# EAGLE schematic AR - Attack Release (EAGLE 6.6.0)

## Sheet 1 of 3: Power
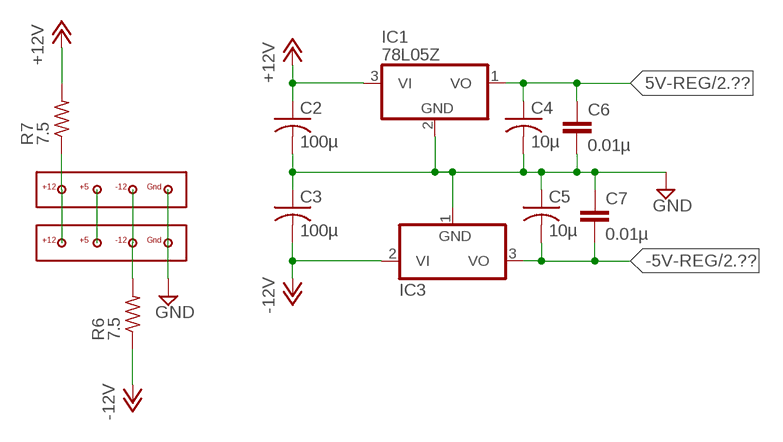
[diagram p0: schematic, sheet 1]

### Parts
C2  100µ  C-US025-050X050  [C025-050X050]
C3  100µ  C-US025-050X050  [C025-050X050]
C4  10µ  C-US025-050X050  [C025-050X050]
C5  10µ  C-US025-050X050  [C025-050X050]
C6  0.01µ  C2.5/2  [C2.5-2]
C7  0.01µ  C2.5/2  [C2.5-2]
IC1  78L05Z  [TO92]
IC3  79L05Z  [TO92]
R6  7.5  R-US_0204/7  [0204/7]
R7  7.5  R-US_0204/7  [0204/7]
U$3  POWER_CONNECTOR_4_RGBB  [POWER_CONNECTOR_4_RGBB]
U$7  POWER_CONNECTOR_4_RGBB  [POWER_CONNECTOR_4_RGBB]

### Nets
5V-REG: C4.1 C6.1 IC1.1(VO) ; also sheet 2
+12V: C2.1 IC1.3(VI) R7.2 ; also sheet 2
-5V-REG: C5.2 C7.2 IC3.3(VO) ; also sheet 2
-12V: C3.2 IC3.2(VI) R6.1 ; also sheet 3
GND: C2.2 C3.1 C4.2 C5.1 C6.2 C7.1 IC1.2(GND) IC3.1(GND) U$3.GND U$7.GND ; also sheet 2,3
N$10: R7.1 U$3.+12 U$7.+12
N$11: U$3.+5 U$7.+5
N$12: R6.2 U$3.-12 U$7.-12

## Sheet 2 of 3: Attack-Release
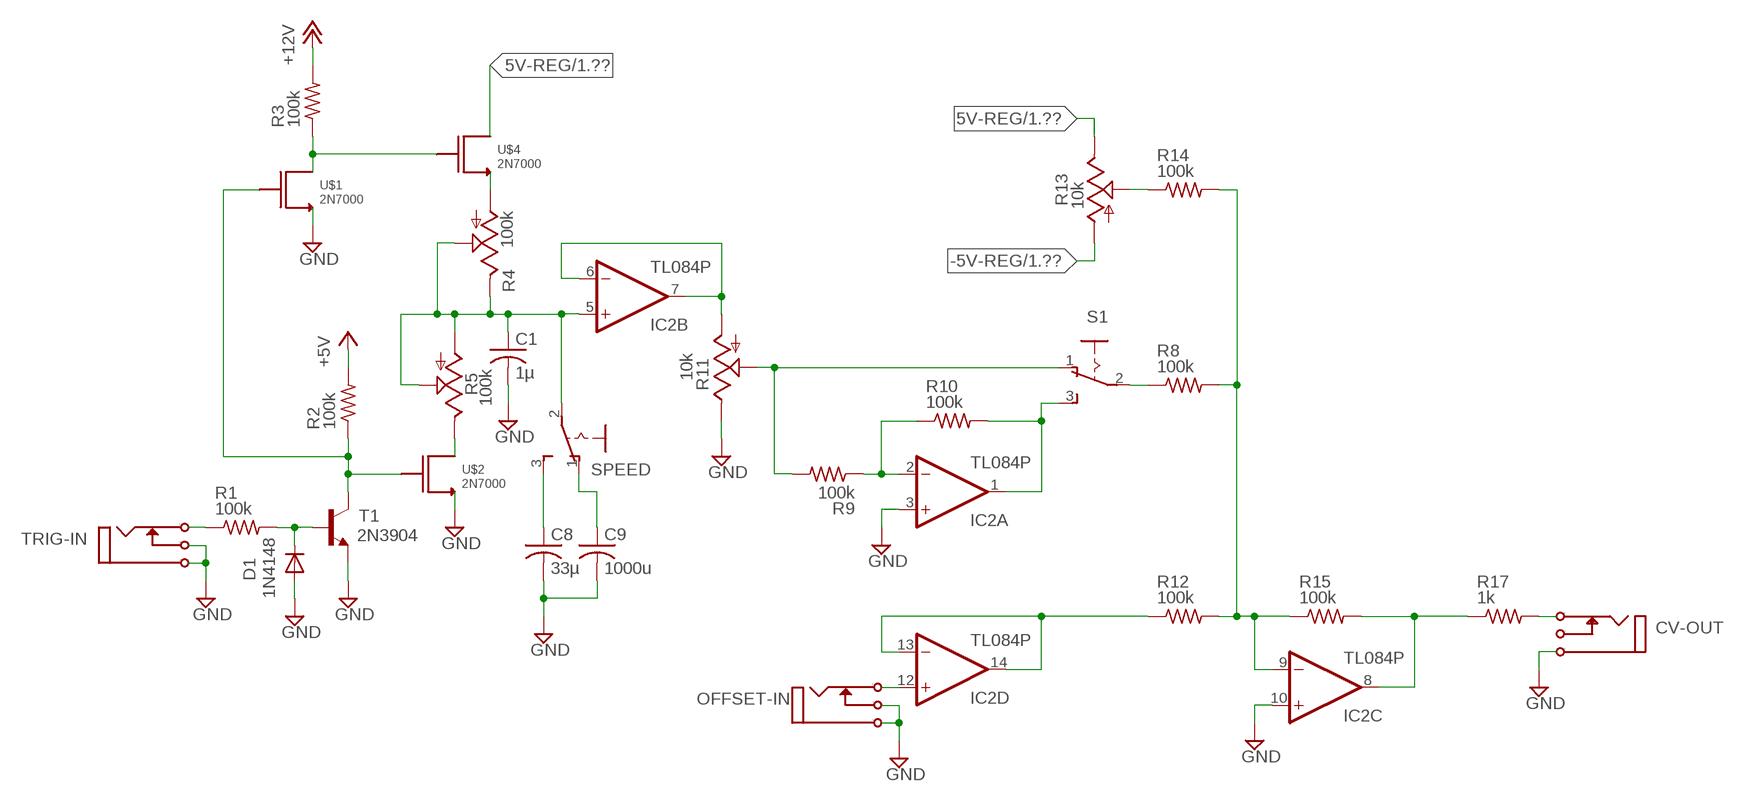
[diagram p1: schematic, sheet 2]

### Parts
C1  1µ  C-US025-050X050  [C025-050X050]
C8  33µ  C-US025-050X050  [C025-050X050]
C9  1000u  C-US025-050X050  [C025-050X050]
CV-OUT  I/O  MONO_JACK  [MONO_JACK]
D1  1N4148  1N4148DO35-7  [DO35-7]
IC2  TL084P  [DIL14]
OFFSET-IN  I/O  MONO_JACK  [MONO_JACK]
R1  100k  R-US_0204/7  [0204/7]
R2  100k  R-US_0204/7  [0204/7]
R3  100k  R-US_0204/7  [0204/7]
R4  100k  TRIM_US-B64Y  [B64Y]
R5  100k  TRIM_US-B64Y  [B64Y]
R8  100k  R-US_0204/7  [0204/7]
R9  100k  R-US_0204/7  [0204/7]
R10  100k  R-US_0204/7  [0204/7]
R11  10k  TRIM_US-B64Y  [B64Y]
R12  100k  R-US_0204/7  [0204/7]
R13  10k  TRIM_US-B64Y  [B64Y]
R14  100k  R-US_0204/7  [0204/7]
R15  100k  R-US_0204/7  [0204/7]
R17  1k  R-US_0204/7  [0204/7]
S1  255SB  [255SB]
SPEED  255SB  [255SB]
T1  2N3904  [TO92]
TRIG-IN  I/O  MONO_JACK  [MONO_JACK]
U$1  2N7000  [2N7000]
U$2  2N7000  [2N7000]
U$4  2N7000  [2N7000]

### Nets
5V-REG: R13.E U$4.D ; also sheet 1
+5V: R2.2
+12V: R3.2 ; also sheet 1
+12V1: C8.1 SPEED.3(S)
-5V-REG: R13.A ; also sheet 1
GND: C1.2 C8.2 C9.2 CV-OUT.P$1 D1.A IC2.3(A:+IN) IC2.10(C:+IN) OFFSET-IN.P$1 OFFSET-IN.P$3(P3) R11.E T1.3(E) TRIG-IN.P$1 TRIG-IN.P$3(P3) U$1.S U$2.S ; also sheet 1,3
N$1: R1.1 TRIG-IN.P$2(P2)
N$2: D1.C R1.2 T1.2(B)
N$3: R2.1 T1.1(C) U$1.G U$2.G
N$4: R3.1 U$1.D U$4.G
N$6: IC2.6(B:-IN) IC2.7(B:OUT) R11.A
N$7: R5.E U$2.D
N$8: C1.1 IC2.5(B:+IN) R4.E R4.S R5.A R5.S SPEED.2(P)
N$9: R4.A U$4.S
N$13: IC2.13(D:-IN) IC2.14(D:OUT) R12.1
N$15: IC2.1(A:OUT) R10.2 S1.3(S)
N$17: R9.2 R11.S S1.1(O)
N$18: IC2.2(A:-IN) R9.1 R10.1
N$19: R8.1 S1.2(P)
N$20: IC2.9(C:-IN) R8.2 R12.2 R14.2 R15.1
N$21: R13.S R14.1
N$23: IC2.8(C:OUT) R15.2 R17.1
N$25: CV-OUT.P$2(P2) R17.2
N$26: C9.1 SPEED.1(O)
N$28: IC2.12(D:+IN) OFFSET-IN.P$2(P2)
Unconnected: CV-OUT.P$3(P3)

## Sheet 3 of 3: VCA
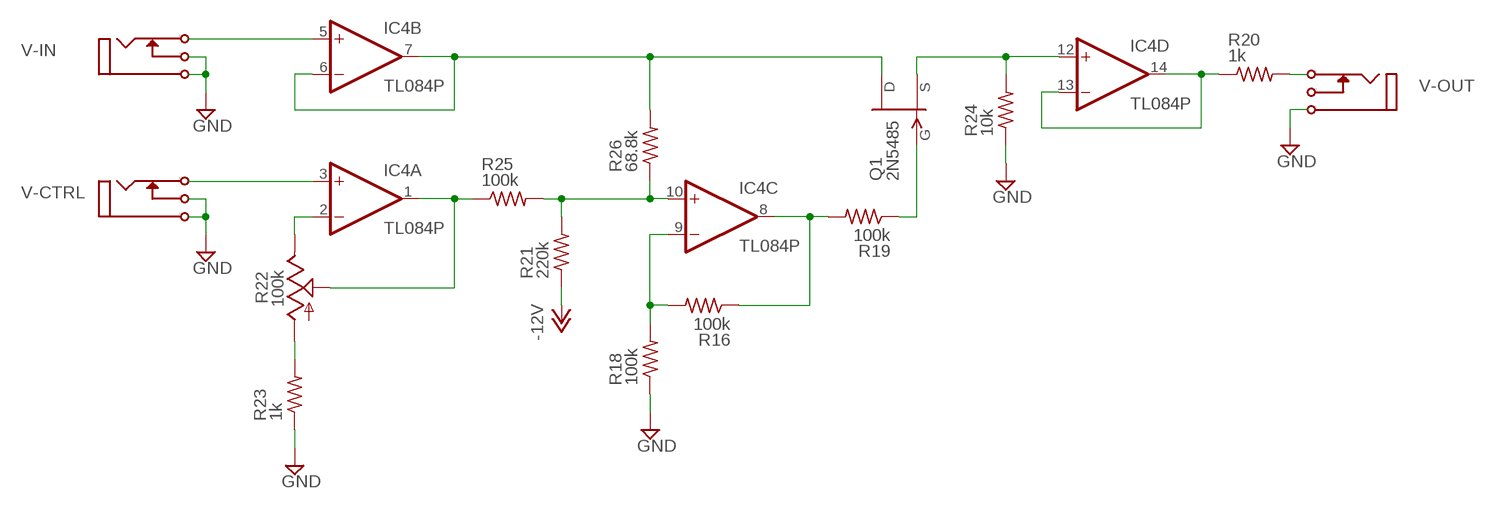
[diagram p2: schematic, sheet 3]

### Parts
IC4  TL084P  [DIL14]
Q1  2N5485  [TO92-]
R16  100k  R-US_0204/7  [0204/7]
R18  100k  R-US_0204/7  [0204/7]
R19  100k  R-US_0204/7  [0204/7]
R20  1k  R-US_0204/7  [0204/7]
R21  220k  R-US_0204/7  [0204/7]
R22  100k  TRIM_US-B64Y  [B64Y]
R23  1k  R-US_0204/7  [0204/7]
R24  10k  R-US_0204/7  [0204/7]
R25  100k  R-US_0204/7  [0204/7]
R26  68.8k  R-US_0204/7  [0204/7]
V-CTRL  I/O  MONO_JACK  [MONO_JACK]
V-IN  I/O  MONO_JACK  [MONO_JACK]
V-OUT  I/O  MONO_JACK  [MONO_JACK]

### Nets
-12V: R21.1 ; also sheet 1
GND: R18.1 R23.1 R24.1 V-CTRL.P$1 V-CTRL.P$3(P3) V-IN.P$1 V-IN.P$3(P3) V-OUT.P$1 ; also sheet 1,2
N$5: IC4.2(A:-IN) R22.E
N$14: IC4.1(A:OUT) R22.S R25.1
N$16: IC4.9(C:-IN) R16.2 R18.2
N$24: IC4.8(C:OUT) R16.1 R19.2
N$27: Q1.1(G) R19.1
N$29: R20.2 V-OUT.P$2(P2)
N$30: R22.A R23.2
N$31: IC4.5(B:+IN) V-IN.P$2(P2)
N$32: IC4.6(B:-IN) IC4.7(B:OUT) Q1.3(D) R26.2
N$33: IC4.3(A:+IN) V-CTRL.P$2(P2)
N$34: IC4.12(D:+IN) Q1.2(S) R24.2
N$35: IC4.10(C:+IN) R21.2 R25.2 R26.1
N$36: IC4.13(D:-IN) IC4.14(D:OUT) R20.1
Unconnected: V-OUT.P$3(P3)

## Power pins joined to a net without a drawn wire
V+: IC2.4(P:V+) IC4.4(P:V+)
V-: IC2.11(P:V-) IC4.11(P:V-)

## Library data of the parts
C1-C5 C8 C9 = rcl:C-US: CAPACITOR, American symbol
C6 C7 = capacitor-wima:C: CAPACITOR naming: grid - package width
CV-OUT OFFSET-IN TRIG-IN V-CTRL V-IN V-OUT = !synth_sch:MONO_JACK
D1 = diode:1N4148: DIODE high speed (Philips)
IC1 = linear:78*: Positive VOLTAGE REGULATOR Source: http://cache.national.com/ds/LM/LM78L05.pdf http://www.fairchildsemi.com/ds/LM/LM7805.pdf
IC2 IC4 = linear:TL084: OP AMP
IC3 = linear:79*: Negative VOLTAGE REGULATOR
Q1 = transistor-fet:?548*: N-Channel JFETs Source: VISHAY 2N5484.pdf Compatible: TO92 2N5245 J304 J305 U310 J308 J309 J310 TO72 2N4416 2N4416A 2N3823 2N4351 3N169 3N170 3N171 MFE3002 TO18 2N3796 2N3797 MFE825 Source: Motorola European Master Guide Pacge 3-59
R1-R3 R6-R10 R12 R14-R21 R23-R26 = resistor:R-US_: RESISTOR, American symbol
R4 R5 R11 R13 R22 = pot:TRIM_US-: POTENTIOMETER
S1 SPEED = switch:255SB: SLIDING SWITCH Distributor Buerklin, 11G810
T1 = transistor:2N3904: NPN TRANSISTOR
U$1 U$2 U$4 = !synth_sch:2N7000
U$3 U$7 = !synth_sch:POWER_CONNECTOR_4_RGBB